# Altium schematic sheet DDS.SchDoc
size A; SheetNumber: 5; SheetTotal: 12
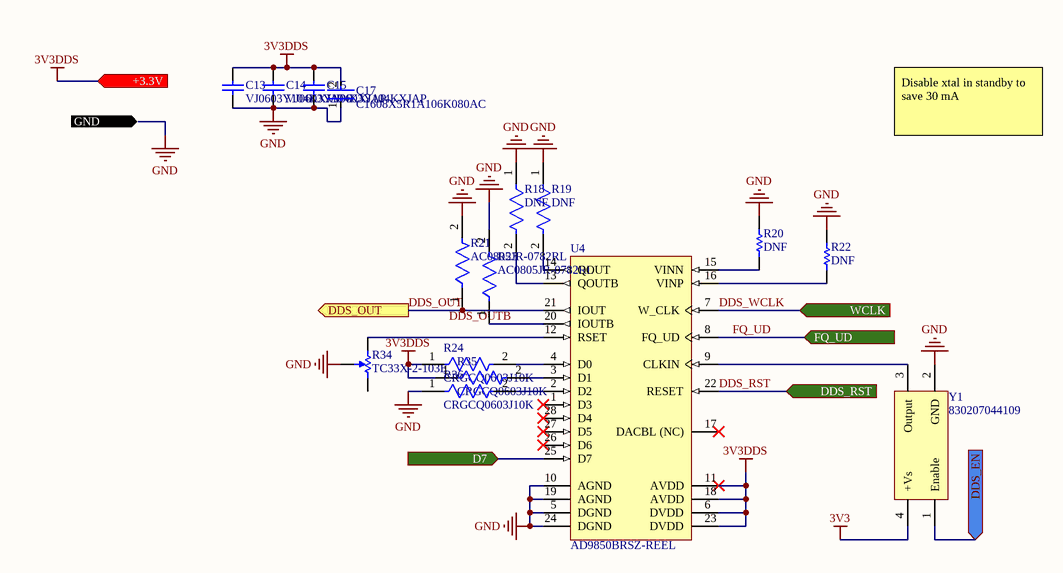
[diagram p0: DDS.SchDoc]

## Parts
C13  VJ0603Y104KXJAP  [CAPC1608X92X38NL15T08]
C14  VJ0603Y104KXJAP  [CAPC1608X92X38NL15T08]
C15  VJ0603Y104KXJAP  [CAPC1608X92X38NL15T08]
C17  C1608X5R1A106K080AC  [FP-C1608-080-0_1-MFG]
R18  DNF  [FP-RMCF0603-IPC_B]
R19  DNF  [FP-RMCF0603-IPC_B]
R20  DNF  [RESC0603(1608)_N]
R21  AC0805JR-0782RL  [FP-AC0805-MFG]
R22  DNF  [RESC0603(1608)_N]
R23  AC0805JR-0782RL  [FP-AC0805-MFG]
R24  CRGCQ0603J10K  [FP-CRGCQ0603-IPC_C]
R34  TC33X-2-103E  [BOUR-TC33X-2_V]
R35  CRGCQ0603J10K  [FP-CRGCQ0603-IPC_C]
R36  CRGCQ0603J10K  [FP-CRGCQ0603-IPC_C]
U4  AD9850BRSZ-REEL  [ADI-RS-28_N]
Y1  830207044109  [WE-SPXO_CFPS-39]

## Ports
+3.3V (in), D7 (in), DDS_EN (in), DDS_OUT (out), DDS_RST (in), FQ_UD (in), GND (in), WCLK (in)

## Nets
3V3: Y1.4(+Vs)
3V3DDS: C13.2 C14.2 C15.2 C17.2 R24.1 R35.1 U4.6(DVDD) U4.11(AVDD) U4.18(AVDD) U4.23(DVDD) ; port +3.3V
GND: C13.1 C14.1 C15.1 C17.1 R18.1 R19.1 R20.2 R21.2 R22.2 R23.2 R34.2 R36.1 U4.5(DGND) U4.10(AGND) U4.19(AGND) U4.24(DGND) Y1.2(GND) ; port GND
D7: U4.25(D7) ; port D7
DDS_EN: Y1.1(Enable) ; port DDS_EN
DDS_OUT: R21.1 U4.21(IOUT) ; port DDS_OUT
DDS_RST: U4.22(RESET) ; port DDS_RST
DDS_WCLK: U4.7(W_CLK) ; port WCLK
FQ_UD: U4.8(FQ_UD) ; port FQ_UD
NetR18_2: R18.2 U4.13(QOUTB)
NetR19_2: R19.2 U4.14(QOUT)
NetR20_1: R20.1 U4.15(VINN)
NetR22_1: R22.1 U4.16(VINP)
NetR23_1: R23.1 U4.20(IOUTB)
NetR24_2: R24.2 U4.4(D0)
NetR34_1: R34.1 U4.12(RSET)
NetR35_2: R35.2 U4.3(D1)
NetR36_2: R36.2 U4.2(D2)
NetU4_9: U4.9(CLKIN) Y1.3(Output)

Not connected (* = marked no-connect by the designer): R34 3; U4 1(D3)* 17(DACBL_(NC))* 26(D6)* 27(D5)* 28(D4)*

## Notes on the sheet
- Disable xtal in standby to save 30 mA
- Labels drawn without touching a wire or pin: DDS_OUTB

## Library data of the parts
C13-C15 = CMP-2006-01211-1: Manufacturer: Vitramon; Part Number: VJ0603Y104KXJAP
C17 = CMP-2000-04979-3: Multilayer Ceramic Capacitors 10μF ±10% 10V X5R SMD 0603; Capacitance: 10uF; Dielectric Material: Ceramic; Construction: Flat; Height: 0.8mm; Thickness: 0.035inch; Case Code (Metric): 1608; Radiation Hardening: No; Number of Pins: 2; Voltage Rating (DC): 10V; Depth: 0.8mm; Voltage: 10V; RoHS Compliant: Yes; Voltage Rating: 10V; Package Quantity: 1; Resistor Type: Ceramic; Termination: SMD/SMT; Lead Free: Lead Free; REACH SVHC: No SVHC; Tolerance: 10%; Mount: Surface Mount; Series: C; Packaging: Tape and Reel; Width: 0.8mm; Dielectric: X5R; Weight: 7.1E-05oz; Length: 1.6mm; Max Operating Temperature: 85°C; Case Code (Imperial): 0603; Case/Package: 0603; Min Operating Temperature: -55°C
R18 R19 = CMP-26527-006412-1: 0Ω ±0 0.1W 0603 Thick Film Chip Resistor AEC-Q200 compliant; Max Power Dissipation: 100mW; Resistance: 0R; Width: 0.031inch; RoHS Compliant: Yes; Number of Terminations: 2; Case/Package: 0603; Contact Plating: Tin; Height: 0.022inch; Resistor Type: Thick Film; Mount: Surface Mount; Length: 0.061inch; Features: Automotive AEC-Q200; Series: RMCF; Max Operating Temperature: 155°C; Radiation Hardening: No; Min Operating Temperature: -55°C; Packaging: Tape and Reel
R20 R22 = CMP-1012-00736-1: 100K 0.1W 1% 0603 (1608 Metric)  SMD; Value: 100000.00 Ohm; Case-Metric: 1608; Case-EIA: 0603; Power: 0.1 W; Tolerance: 1 %; Technology: SMT
R21 R23 = CMP-03412-037249-1: RES SMD 82 OHM 5% 1/8W 0805; Manufacturer: Yageo; Tolerance: 0.05; Value: 82Ω; Automotive Grade: Grade 0; Voltage Rating: 150V; Footprint Url: http://www.yageo.com/exep/pages/download/literatures/PYu-R_Mount_10.pdf; Ipc Land Pattern Name: RESC200125X50; Package: AC0805; Category: Res; Height: 0.6mm; Temperature Range High: +155°C; Digikey Description: RES SMD 82 OHM 5% 1/8W 0805; Device Class L2: Resistors; Power Rating: 1/8W; ComponentLink2URL: http://www.yageo.com/documents/recent/PYu-AC_51_RoHS_L_6.pdf; Mouser Description: Thick Film Resistors - SMD 1/8W 82ohm 5% AEC-Q200; Temperature: -55°C to +155°C; Octopart: https://octopart.com/ac0805jr-0782rl-yageo-71367939; Resistance: 82Ω; Composition: Thick Film; Device Class L3: Chip SMD Resistors; ComponentLink2Description: Datasheet; Device Class L1: Passive Components; Series: AC; Temperature Range Low: -55°C; RoHS: TRUE; Lead Free: Yes; Manufacturer Part Number: AC0805JR-0782RL; Automotive: Yes
R24 R35 R36 = CMP-03211-009884-1: CRGCQ 0603 10K 5%; Manufacturer: TE Connectivity; Tolerance: 0.05; Power Rating: 0.1W; Resistance: 10KΩ; Voltage Rating: 75V; Value: 10KΩ; Temperature Coefficient: ±100ppm/°C; Composition: Thick Film; ComponentLink2URL: https://www.te.com/commerce/DocumentDelivery/DDEController?Action=showdoc&DocId=Data+Sheet%7F1773204-3%7F1%7Fpdf%7FEnglish%7FENG_DS_1773204-3_1.pdf%7F4-2176339-923; Device Class L1: Passive Components; Package: CRGCQ0603; Mouser Description: Res Thick Film 0603 10K Ohm 5% 0.1W(1/10W) ±100ppm/C Pad SMD Automotive T/R; Temperature Range High: +155°C; Category: Res; Device Class L2: Resistors; Height: 0.55mm; RoHS: TRUE; Lead Free: Yes; Ipc Land Pattern Name: RESC16080X45; Temperature: -55°C to +155°C; Series: CRGCQ; Digikey Description: CRGCQ 0603 10K 5%; Octopart: https://octopart.com/crgcq0603j10k-te+connectivity-91018097; Device Class L3: Chip SMD Resistors; Ambient Temperature Range High: +70°C; ComponentLink2Description: Datasheet; Temperature Range Low: -55°C; Manufacturer Part Number: CRGCQ0603J10K
R34 = CMP-2100-03695-1: Trimming Potentiometer, 10000 Ohm, -40 to 100 degC, 3-Pin SMD, RoHS, Tape and Reel; Manufacturer: Bourns; Tolerance: 25%; Max Power Dissipation: 100mW; Number of Turns: 1; Resistance: 10KOhm; Temperature Coefficient: 250ppm/degreesC; Voltage Rating (DC): 50V; Datasheet URL: http://www.bourns.com/docs/Product-Datasheets/TC33.pdf; Composition: Potentiometer; Package Description: 3-Pin Surface Mount Device, Body 3.8 x 3.6 mm; Weight: 29.4mg; Power Rating: 100mW; Termination: FootPrint; Manufacturer URL: http://www.bourns.com/; Width: 0.118inch; Height: 0.047inch; Military Standard: Not; Radiation Hardening: No; Colour: Silver; Case/Package: SMD/SMT; Depth: 3.8mm; Min Operating Temperature: -40degC; Lead Free: LeadFree; Datasheet Version: 42583.0; REACH SVHC: NoSVHC; Length: 3mm; RoHSCompliant: true; Contact Plating: Silver; Taper: Linear; Packaging: TapeandReel; Mount: SurfaceMount; Max Operating Temperature: 100degC; Package Reference: TC33X-2; Package Quantity: 2500
U4 = CMP-0293-00041-1: CMOS, 125 MHz Complete DDS Synthesizer, 10-Bit, Parallel, Serial, RS-28, 1500 Reel, Pb-Free; Tuning Word Width (bits): 32bit; Master fclk: 125MHz; Resolution (Bits): 10bit; REFCLK Multiplier: No; Compliance Range (V): 1.5V; FS Iout (mA nom): 20mA; I Supply total (max): 96mA; ComponentLink3Description: Package Specification; Code_JEDEC: MO-150-AH; ComponentLink1URL: www.analog.com; I/O Interface: Parallel, Serial; PackageDescription: 28-Lead Shrink Small Outline Package [SSOP]; ComponentLink2URL: http://www.analog.com/static/imported-files/data_sheets/AD9850.pdf; ComponentLink3URL: http://www.analog.com/static/imported-files/packages/32122249223724RS_28.pdf; ComponentLink2Description: Datasheet; PackageVersion: revA, 1997; ComponentLink1Description: Manufacturer URL; PackageReference: RS-28; DatasheetVersion: Rev. H
Y1 = CMP-03913-116855802-1: 830207044109 WE-SPXO Crystal Oscillator; Frequency: 100MHz; NexarPartId: 116855802; Length: 3.2mm; Width: 2.5mm; Max Operating Temperature: 85°C; Height: 1.2mm; Min Operating Temperature: -40°C